# EAGLE board JKW_standalone (EAGLE 5.11), part 1 of 2
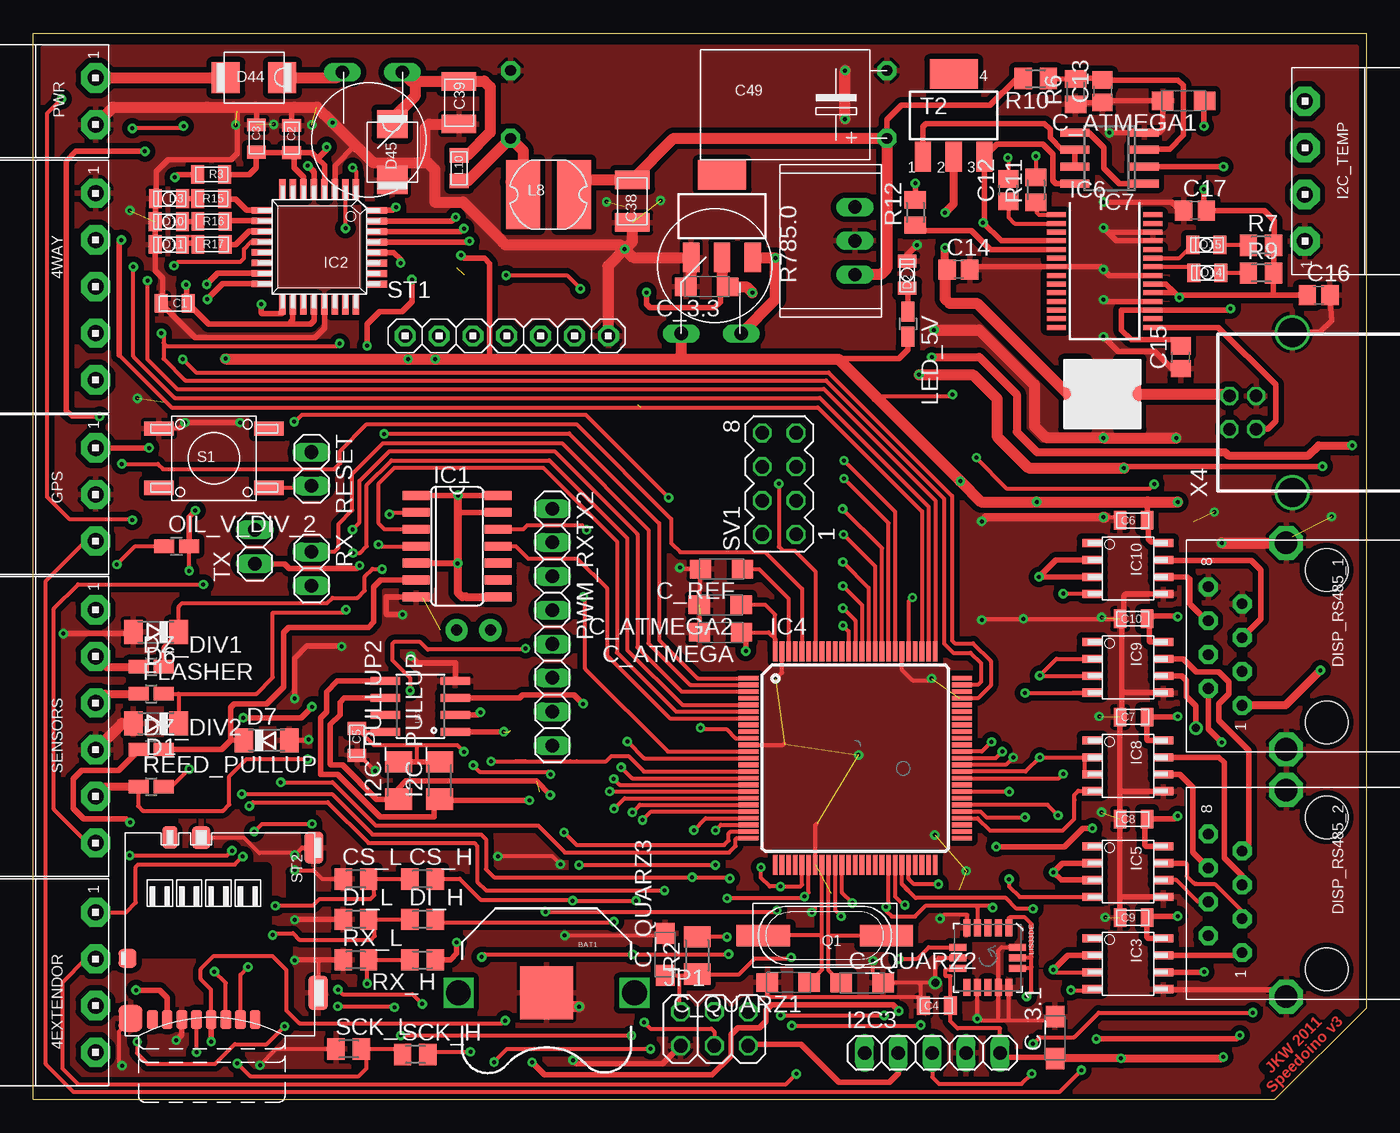
[diagram p2: board, top side]
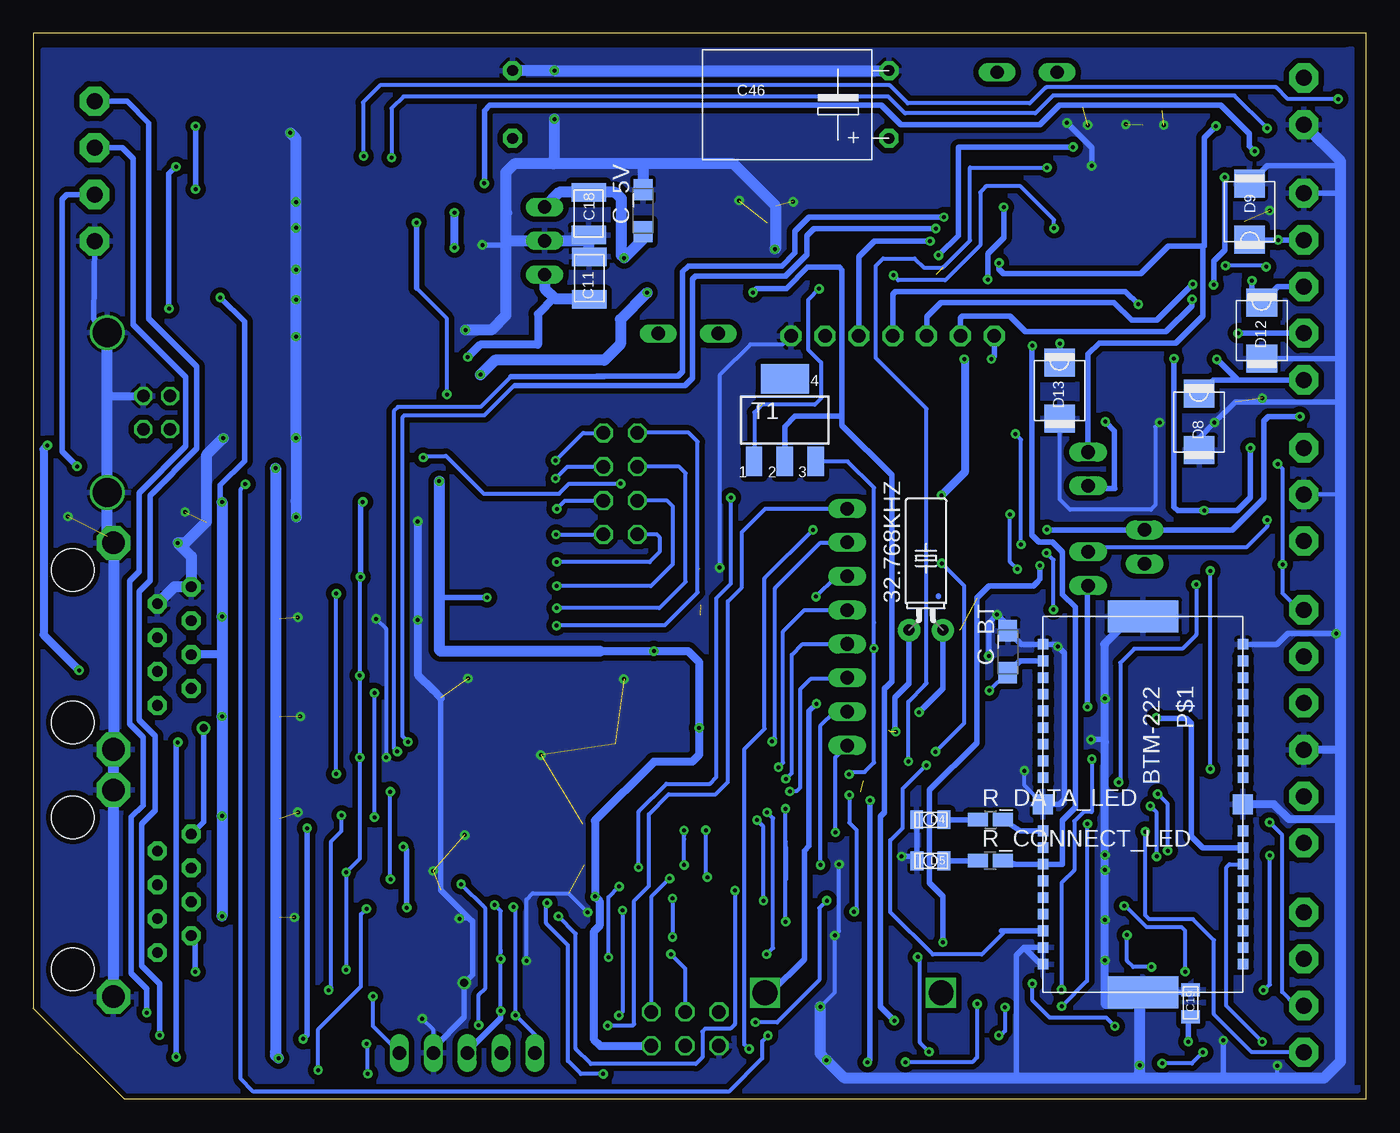
[diagram p3: board, bottom side, seen from below]

Size 100 x 79.99 mm. Coordinates in mm from the lower left corner, seen from the top.
Outline: 0,0 0,79.99 100,79.99 100,6.84 93.16,0 0,0
Copper layers (1*16): Top 0.035mm / dielectric 1.5mm / Bottom 0.035mm
Design rules "ZWILLING *": minimum track width 0.15mm, minimum drill 0.299mm, track to track 0.15mm, track to pad 0.15mm, pad to pad 0.15mm, via to via 0.15mm, smd to smd 0mil, copper to edge 0.15mm, drill to drill 0.15mm, minimum pad ring 0.2mm, minimum via ring 0.2mm, stop-mask expansion 0.1mm, vias tented up to drill 0mil, thermal gap 10mil
Net classes: 0 default: width 0.203 mm, drill 0.406 mm, clearance 0.203 mm; 1 power: width 0.61 mm, drill 0.711 mm, clearance 0.203 mm; 2 gnd: width 0.305 mm, drill 0.711 mm, clearance 0.203 mm; 3 usbvcc: width 0.508 mm, drill 0.711 mm, clearance 0.203 mm

## Footprints (pad centres in the part's own frame; a part is rotated, then mirrored left to right if it is on the bottom)
MCG35-04 = drill 1.2 pad 2.184 octagon: 1 -5.25,0; 2 -1.75,0; 3 1.75,0; 4 5.25,0
MCG35-05 = drill 1.2 pad 2.184 octagon: 1 -7,0; 2 -3.5,0; 3 0,0; 4 3.5,0; 5 7,0
KOLJA_FUSE = drill 1 long: IN -2.5,0; OUT 2,0
TC38H = drill 0.813 pad 1.676 round: 1 -1.27,0; 2 1.27,0
BATTCON_12MM_PTH = smd 3.962 x 3.962: GND 0,0 | drill 1.854 square: VCC@1 -6.604,0; VCC@2 6.604,0
0805 = smd 0.965 x 1.397: 1 -1.016,0; 2 1.016,0
1210 = smd 1.397 x 2.591: 1 -1.6,0; 2 1.6,0
C0805 = smd 1.3 x 1.5: 1 -0.85,0; 2 0.85,0
EL-5-8X13 = drill 0.8 pad 1.422 octagon: 1 0,-2.54; 2 0,2.54
SMC_P = smd 1.6 x 1.4: + -1.575,0; - 1.575,0
M0805 = smd 1.3 x 1.6: 1 -0.95,0; 2 0.95,0
SOD80C = smd 1.4 x 1.8: A 1.7,0; C -1.7,0
LED-0805 = smd 0.965 x 1.397: 1 -1.016,0; 2 1.016,0
SMB = smd 2.1 x 2.3: A -2.114,0; K 2.114,0
RJ45_AMJ-188-0010100-CAT5 = drill 0.8 pad 1.422 octagon: 1 -4.445,6.35; 2 -3.175,8.89; 3 -1.905,6.35; 4 -0.635,8.89; 5 0.635,6.35; 6 1.905,8.89; 7 3.175,6.35; 8 4.445,8.89 | drill 1.7 pad 2.54 octagon: G1 -7.75,3.05; G2 7.75,3.05 | hole 3.2: 5.715,0; -5.715,0
R0805W = smd 1.5 x 1: 1 -0.94,0; 2 0.94,0
MCG35-03 = drill 1.2 pad 2.184 octagon: 1 -3.5,0; 2 0,0; 3 3.5,0
1X05 = drill 1.016 long: 1 -5.08,0; 2 -2.54,0; 3 0,0; 4 2.54,0; 5 5.08,0
M1206 = smd 1.6 x 2: 1 -1.4,0; 2 1.4,0
SO14 = smd 0.66 x 2.032: 1 -3.81,-3.073; 2 -2.54,-3.073; 3 -1.27,-3.073; 4 0,-3.073; 5 1.27,-3.073; 6 2.54,-3.073; 7 3.81,-3.073; 8 3.81,3.073; 9 2.54,3.073; 10 1.27,3.073; 11 0,3.073; 12 -1.27,3.073; 13 -2.54,3.073; 14 -3.81,3.073
TQFP-32_7X7 = smd 0.508 x 1.5: 1 -2.756,-4.331; 2 -1.968,-4.331; 3 -1.181,-4.331; 4 -0.394,-4.331; 5 0.394,-4.331; 6 1.181,-4.331; 7 1.968,-4.331; 8 2.756,-4.331; 17 2.756,4.331; 18 1.968,4.331; 19 1.181,4.331; 20 0.394,4.331; 21 -0.394,4.331; 22 -1.181,4.331; 23 -1.968,4.331; 24 -2.756,4.331 | smd 1.5 x 0.508: 9 4.331,-2.756; 10 4.331,-1.968; 11 4.331,-1.181; 12 4.331,-0.394; 13 4.331,0.394; 14 4.331,1.181; 15 4.331,1.968; 16 4.331,2.756; 25 -4.331,2.768; 26 -4.331,1.981; 27 -4.331,1.194; 28 -4.331,0.406; 29 -4.331,-0.381; 30 -4.331,-1.169; 31 -4.331,-1.956; 32 -4.331,-2.756
SO-8 = smd 0.61 x 1.524: 1 -1.905,-2.661; 2 -0.635,-2.661; 3 0.635,-2.661; 4 1.905,-2.661; 5 1.905,2.661; 6 0.635,2.661; 7 -0.635,2.661; 8 -1.905,2.661
TQFP100 = smd 1.5 x 0.35: 1 -8,6; 2 -8,5.5; 3 -8,5; 4 -8,4.5; 5 -8,4; 6 -8,3.5; 7 -8,3; 8 -8,2.5; 9 -8,2; 10 -8,1.5; 11 -8,1; 12 -8,0.5; 13 -8,0; 14 -8,-0.5; 15 -8,-1; 16 -8,-1.5; 17 -8,-2; 18 -8,-2.5; 19 -8,-3; 20 -8,-3.5; 21 -8,-4; 22 -8,-4.5; 23 -8,-5; 24 -8,-5.5; 25 -8,-6; 51 8,-6; 52 8,-5.5; 53 8,-5; 54 8,-4.5; 55 8,-4; 56 8,-3.5; 57 8,-3; 58 8,-2.5; 59 8,-2; 60 8,-1.5; 61 8,-1; 62 8,-0.5; 63 8,0; 64 8,0.5; 65 8,1; 66 8,1.5; 67 8,2; 68 8,2.5; 69 8,3; 70 8,3.5; 71 8,4; 72 8,4.5; 73 8,5; 74 8,5.5; 75 8,6 | smd 0.35 x 1.5: 26 -6,-8; 27 -5.5,-8; 28 -5,-8; 29 -4.5,-8; 30 -4,-8; 31 -3.5,-8; 32 -3,-8; 33 -2.5,-8; 34 -2,-8; 35 -1.5,-8; 36 -1,-8; 37 -0.5,-8; 38 0,-8; 39 0.5,-8; 40 1,-8; 41 1.5,-8; 42 2,-8; 43 2.5,-8; 44 3,-8; 45 3.5,-8; 46 4,-8; 47 4.5,-8; 48 5,-8; 49 5.5,-8; 50 6,-8; 76 6,8; 77 5.5,8; 78 5,8; 79 4.5,8; 80 4,8; 81 3.5,8; 82 3,8; 83 2.5,8; 84 2,8; 85 1.5,8; 86 1,8; 87 0.5,8; 88 0,8; 89 -0.5,8; 90 -1,8; 91 -1.5,8; 92 -2,8; 93 -2.5,8; 94 -3,8; 95 -3.5,8; 96 -4,8; 97 -4.5,8; 98 -5,8; 99 -5.5,8; 100 -6,8
SSOP28 = smd 0.381 x 1.499: 1 -4.225,-3.625; 2 -3.575,-3.625; 3 -2.925,-3.625; 4 -2.275,-3.625; 5 -1.625,-3.625; 6 -0.975,-3.625; 7 -0.325,-3.625; 8 0.325,-3.625; 9 0.975,-3.625; 10 1.625,-3.625; 11 2.275,-3.625; 12 2.925,-3.625; 13 3.575,-3.625; 14 4.225,-3.625; 15 4.225,3.625; 16 3.575,3.625; 17 2.925,3.625; 18 2.275,3.625; 19 1.625,3.625; 20 0.975,3.625; 21 0.325,3.625; 22 -0.325,3.625; 23 -0.975,3.625; 24 -1.625,3.625; 25 -2.275,3.625; 26 -2.925,3.625; 27 -3.575,3.625; 28 -4.225,3.625
SO08 = smd 0.6 x 2.2: 1 -1.905,-2.6; 2 -0.635,-2.6; 3 0.635,-2.6; 4 1.905,-2.6; 5 1.905,2.6; 6 0.635,2.6; 7 -0.635,2.6; 8 -1.905,2.6
2X03 = drill 1.016 octagon: 1 -2.54,-1.27; 2 -2.54,1.27; 3 0,-1.27; 4 0,1.27; 5 2.54,-1.27; 6 2.54,1.27
L-PD54 = smd 2.54 x 5.2: 1 -1.905,0; 2 1.905,0
0805+603 = smd 1.11 x 1.43: 1 -0.953,0; 2 0.953,0
LGA16 = smd 1.27 x 0.508: 1 -2.235,1.575; 2 -2.235,0.787; 3 -2.235,0; 4 -2.235,-0.787; 5 -2.235,-1.575; 9 2.235,-1.575; 10 2.235,-0.787; 11 2.235,0; 12 2.235,0.787; 13 2.235,1.575 | smd 0.508 x 1.27: 6 -0.787,-2.235; 7 0,-2.235; 8 0.787,-2.235; 14 0.787,2.235; 15 0,2.235; 16 -0.787,2.235
BTM-222 = smd 0.8 x 0.8: P$1 -12.635,-7.5; P$2 -11.385,-7.5; P$3 -10.135,-7.5; P$4 -8.885,-7.5; P$5 -7.635,-7.5; P$6 -6.385,-7.5; P$7 -5.135,-7.5; P$8 -3.885,-7.5; P$9 -2.635,-7.5; P$11 1.365,-7.5; P$12 2.615,-7.5; P$13 3.865,-7.5; P$14 5.115,-7.5; P$15 6.365,-7.5; P$16 7.615,-7.5; P$17 8.865,-7.5; P$18 10.115,-7.5; P$19 11.365,-7.5; P$20 11.365,7.5; P$21 10.115,7.5; P$22 8.865,7.5; P$23 7.615,7.5; P$24 6.365,7.5; P$25 5.115,7.5; P$26 3.865,7.5; P$27 2.615,7.5; P$28 1.365,7.5; P$30 -2.635,7.5; P$31 -3.885,7.5; P$32 -5.135,7.5; P$33 -6.385,7.5; P$34 -7.635,7.5; P$35 -8.885,7.5; P$36 -10.135,7.5; P$37 -11.385,7.5; P$38 -12.635,7.5 | smd 1.5 x 1.5: P$10 -0.635,-7.5; P$29 -0.635,7.5 | smd 2.4 x 5.3: P$AGND -14.735,0; P$BGND 13.465,0
1X08 = drill 1.016 long: 1 -8.89,0; 2 -6.35,0; 3 -3.81,0; 4 -1.27,0; 5 1.27,0; 6 3.81,0; 7 6.35,0; 8 8.89,0
MCG35-02 = drill 1.2 pad 2.184 octagon: 1 -1.75,0; 2 1.75,0
XT-HC49S-SMD = smd 4 x 1.6: 1 -4.617,0; 2 4.617,0
SIP-3 = drill 1 long: GND -0.635,-1.81; V_IN 1.905,-1.81; V_OUT -3.175,-1.81
1X02 = drill 1.016 long: 1 -1.27,0; 2 1.27,0
SW-ECO = smd 2.184 x 1.067: 1 -4.128,2.223; 2 -4.128,-2.223; 3 4.128,2.223; 4 4.128,-2.223
MCG35-06 = drill 1.2 pad 2.184 octagon: 1 -8.75,0; 2 -5.25,0; 3 -1.75,0; 4 1.75,0; 5 5.25,0; 6 8.75,0
1X07 = drill 1.016 pad 1.575 octagon: 1 -7.62,0; 2 -5.08,0; 3 -2.54,0; 4 0,0; 5 2.54,0; 6 5.08,0; 7 7.62,0
SD-CARD-MICRO_PJS008-2100-0 = smd 1.4 x 0.8: 1 0.7,2.65; 2 0.7,1.55; 3 0.7,0.45; 4 0.7,-0.65; 5 0.7,-1.75; 6 0.7,-2.85; 7 0.7,-3.95; 8 0.7,-5.05 | smd 1.72 x 1.4: G1 -12.94,-1.4 | smd 2.4 x 1.4: G2 -12.2,7.05 | smd 2.6 x 1.45: G3 -1.3,7.38 | smd 2 x 1.8: G4 0.6,-6.7 | smd 1.4 x 1.35: S1 -3.9,-6.925 | smd 1.67 x 1.1: S2 -12.96,-3.75
MA04-2 = drill 1.016 octagon: 1 -3.81,-1.27; 2 -3.81,1.27; 3 -1.27,-1.27; 4 -1.27,1.27; 5 1.27,-1.27; 6 1.27,1.27; 7 3.81,-1.27; 8 3.81,1.27
SOT223 = smd 1.219 x 2.235: 1 -2.311,-3.099; 2 0,-3.099; 3 2.311,-3.099 | smd 3.6 x 2.2: 4 0,3.099
SO08' = smd 0.61 x 2.21: 1 -1.905,-2.616; 2 -0.635,-2.616; 3 0.635,-2.616; 4 1.905,-2.616; 5 1.905,2.616; 6 0.635,2.616; 7 -0.635,2.616; 8 -1.905,2.616
SMD_POLYFUSE = smd 1.7 x 5.25: P$1 -2.05,0; P$2 2.05,0
PN61729 = drill 0.95 octagon: 1 1.25,4.71; 2 -1.25,4.71; 3 -1.25,2.71; 4 1.25,2.71 | drill 2.2 round: P$1 -6,0; P$2 6,0

## Placement (x,y rotation side)
4EXTENDOR  [MCG35-04]  4.67,8.79 270 top
4WAY  [MCG35-05]  4.67,60.99 270 top
5V  600mA  [KOLJA_FUSE]  51.12,57.47 0 top
12V  1.1A  [KOLJA_FUSE]  25.18,77.07 180 top
32.768KHZ  12,5pF  [TC38H]  33.02,35.21 0 bottom
BAT1  [BATTCON_12MM_PTH]  38.5,7.99 180 top
C1  100nF  [0805]  10.6,59.72 180 top
C2  100nF  [0805]  19.38,72.06 270 top
C3  100nF  [0805]  16.75,72.1 270 top
C4  100n  [0805]  67.8,7.03 0 top
C5  100n  [0805]  24.28,26.82 270 top
C6  100n  [0805]  82.55,43.44 0 top
C7  100n  [0805]  82.55,28.69 0 top
C8  100n  [0805]  82.55,21.03 0 top
C9  100n  [0805]  82.55,13.63 0 top
C10  100n  [0805]  82.55,36.06 0 top
C11  100n/20V  [1210]  58.29,61.62 90 bottom
C12  100n  [C0805]  73.14,68.22 90 top
C13  100n  [C0805]  80.22,75.64 90 top
C14  100n  [C0805]  69.41,62.27 0 top
C15  100n  [C0805]  86.08,55.68 90 top
C16  100n  [C0805]  96.43,60.34 0 top
C17  100n  [C0805]  87.15,66.7 0 top
C18  100n/20V  [1210]  58.34,66.46 270 bottom
C19  100n  [0805]  13.17,7.2 270 bottom
C38  2µ2/100V  [1210]  44.94,67.4 90 top
C39  2µ2/100V  [1210]  31.93,74.78 270 top
C46  470µ  [EL-5-8X13]  35.81,74.65 0 bottom
C49  470µ  [EL-5-8X13]  64.04,74.65 0 top
C_3.1  10µF  [SMC_P]  76.65,4.64 90 top
C_3.3  10µF  [SMC_P]  50.53,60.98 180 top
C_5V  100nF  [SMC_P]  54.26,66.69 90 bottom
C_ATMEGA  100nF  [SMC_P]  51.56,35.05 180 top
C_ATMEGA1  100nF  [SMC_P]  86.3,74.92 180 top
C_ATMEGA2  100nF  [SMC_P]  51.53,37.11 180 top
C_BT  200nF  [SMC_P]  26.89,33.58 90 bottom
C_QUARZ1  22pF  [SMC_P]  56.64,8.77 180 top
C_QUARZ2  22pF  [SMC_P]  62.18,8.75 0 top
C_QUARZ3  22pF  [SMC_P]  47.41,10.88 90 top
C_REF  100nF  [SMC_P]  51.64,39.79 180 top
CS_H  1k2  [M0805]  29.2,16.54 0 top
CS_L  2k7  [M0805]  24.2,16.54 0 top
D1  5V-Zdiode  [SOD80C]  9.21,28.22 180 top
D2  [LED-0805]  65.56,61.88 90 top
D3  [LED-0805]  10.18,67.58 180 top
D4  [LED-0805]  32.71,20.98 180 bottom
D5  [LED-0805]  32.69,17.9 180 bottom
D6  20V-Zdiode  [SOD80C]  9.21,35.07 180 top
D7  20V-Zdiode  [SOD80C]  17.51,26.95 0 top
D8  SM6T30V  [SMB]  12.53,50.83 90 bottom
D9  SM6T30V  [SMB]  8.76,66.61 270 bottom
D10  [LED-0805]  10.17,65.86 180 top
D11  [LED-0805]  10.17,64.14 180 top
D12  SM6T30V  [SMB]  7.83,57.68 90 bottom
D13  SM6T30V  [SMB]  23,53.18 90 bottom
D14  [LED-0805]  88.08,62.02 180 top
D15  [LED-0805]  88.01,64.12 180 top
D44  SS24  [SMB]  16.56,76.66 0 top
D45  SM6T30V  [SMB]  26.93,71.07 90 top
DI_H  1k2  [M0805]  29.2,13.51 0 top
DI_L  2k7  [M0805]  24.2,13.51 0 top
DISP_RS485_1  [RJ45_AMJ-188-0010100-CAT5]  97.04,34.01 90 top
DISP_RS485_2  [RJ45_AMJ-188-0010100-CAT5]  97.04,15.46 90 top
DZ_DIV1  5k  [R0805W]  8.84,32.46 0 top
DZ_DIV2  5k  [R0805W]  8.84,26.26 0 top
FLASHER  470k  [R0805W]  8.84,30.43 0 top
GPS  [MCG35-03]  4.67,45.39 270 top
I2C3  [1X05]  67.44,3.49 0 top
I2C_PULLUP  10K  [M1206]  30.48,23.92 90 top
I2C_PULLUP2  10K  [M1206]  27.41,23.92 90 top
I2C_TEMP  [MCG35-04]  95.41,69.65 90 top
IC1  4093D  [SO14]  31.79,41.51 270 top
IC2  AT-MEGA-8  [TQFP-32_7X7]  21.45,63.95 180 top
IC3  MAX485SO-8  [SO-8]  82.12,10.18 270 top
IC4  ATMEGA2560-16AU  [TQFP100]  61.67,25.6 0 top
IC5  MAX485SO-8  [SO-8]  82.12,17.09 270 top
IC6  FT232RL  [SSOP28]  80.37,62.15 270 top
IC7  LM358D  [SO08]  80.74,70.63 90 top
IC8  MAX485SO-8  [SO-8]  82.12,25.03 270 top
IC9  MAX485SO-8  [SO-8]  82.12,32.42 270 top
IC10  MAX485SO-8  [SO-8]  82.12,39.84 270 top
JP1  ICSP  [2X03]  51.1,5.29 0 top
L8  22µH 1A  [L-PD54]  38.65,67.89 0 top
L10  BLM21PG221SN1  [0805+603]  31.95,69.87 270 top
LED_5V  1k  [R0805W]  65.62,58.19 270 top
LIS33DE  LIS33DE  [LGA16]  71.61,10.63 270 top
OIL_V_DIV_2  220  [R0805W]  10.75,41.51 0 top
P$1  BTM-222  [BTM-222]  16.74,21.51 270 bottom
PWM_RXTX2  [1X08]  38.94,35.44 270 top
PWR  [MCG35-02]  4.67,74.89 270 top
Q1  16Mhz  [XT-HC49S-SMD]  59.39,12.3 180 top
R2  10K  [M1206]  49.8,10.8 90 top
R3  10R  [0805]  13.34,69.4 180 top
R6  10k  [M0805]  78.19,75.61 90 top
R7  1k  [M0805]  92.11,64.08 0 top
R9  1k  [M0805]  92.1,62 0 top
R10  10k  [M0805]  75.21,76.6 180 top
R11  1K  [M0805]  75.22,68.24 90 top
R12  1K  [M0805]  66.17,66.54 90 top
R15  1k  [0805]  13.34,67.58 180 top
R16  1k  [0805]  13.37,65.87 180 top
R17  1k  [0805]  13.37,64.15 180 top
R785.0  R-785.0-1.0  [SIP-3]  59.83,65.06 90 top
R_CONNECT_LED  220R  [R0805W]  28.2,17.92 0 bottom
R_DATA_LED  220R  [R0805W]  28.18,20.98 0 bottom
REED_PULLUP  12k  [R0805W]  8.84,23.47 0 top
RESET  [1X02]  20.87,47.3 270 top
RX  [1X02]  20.87,39.82 270 top
RX_H  1k2  [M0805]  29.2,10.47 180 top
RX_L  2k7  [M0805]  24.2,10.47 0 top
S1  [SW-ECO]  13.55,48.11 0 top
SCK_H  1k2  [M0805]  28.65,3.37 0 top
SCK_L  2k7  [M0805]  23.66,3.79 0 top
SENSORS  [MCG35-06]  4.67,27.99 270 top
ST1  [1X07]  35.52,57.29 0 top
ST2  SD-CARD-MICRO  [SD-CARD-MICRO_PJS008-2100-0]  13.99,6.69 270 top
SV1  [MA04-2]  55.96,46.2 90 top
T1  NDT2955  [SOT223]  43.62,50.97 0 bottom
T2  NDT2955  [SOT223]  69.05,73.84 0 top
TX  [1X02]  16.62,41.46 90 top
U$1  DS1307ZN+ SO8  [SO08']  29.04,29.49 90 top
U$2  AP1117E33G  [SOT223]  51.67,66.27 0 top
U$3  SMD_POLYFUSE  [SMD_POLYFUSE]  80.21,52.92 180 top
X4  [PN61729]  94.45,51.54 90 top